# EAGLE design usb-volume (EAGLE 7.2.0)
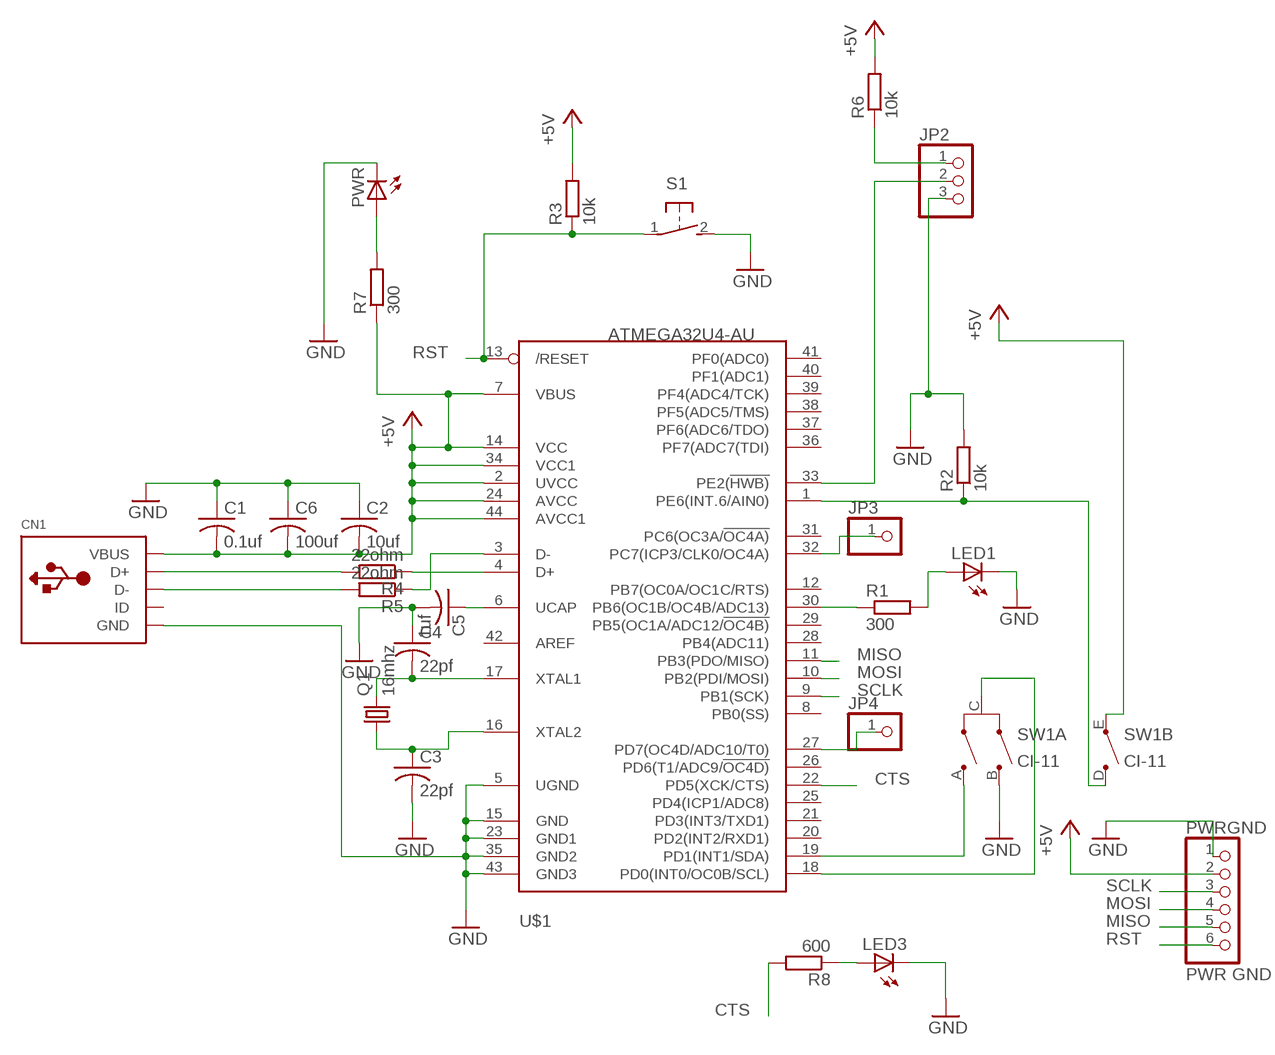
[diagram p0: schematic, sheet 1]

## Parts
C1  0.1uf  C-USC0805  [C0805]
C2  10uf  C-USC0805  [C0805]
C3  22pf  C-US025-025X050  [C025-025X050]
C4  22pf  C-US025-025X050  [C025-025X050]
C5  1uf  C-USC0805  [C0805]
C6  100uf  C-USC0805  [C0805]
CN1  USBMINIB  [USB-MINIB]
JP2  PINHD-1X3  [1X03]
JP3  PINHD-1X1  [1X01]
JP4  PINHD-1X1  [1X01]
LED1  LED5MM  [LED5MM]
LED3  LEDCHIPLED_1206  [CHIPLED_1206]
PWR  LEDCHIPLED_1206  [CHIPLED_1206]
PWRGND  PWR GND  PINHD-1X6  [1X06]
Q1  16mhz  CRYSTALHC49S  [HC49/S]
R1  300  R-EU_R0805  [R0805]
R2  10k  R-EU_R0805  [R0805]
R3  10k  R-EU_R0805  [R0805]
R4  22ohm  R-EU_R0805  [R0805]
R5  22ohm  R-EU_R0805  [R0805]
R6  10k  R-EU_R0805  [R0805]
R7  300  R-EU_R0805  [R0805]
R8  600  R-EU_R0805  [R0805]
S1  31-XX  [B3F-31XX]
SW1  CI-11  [CI-11]
U$1  ATMEGA32U4-AU  [TQFP44]

## Nets
+5V: C1.2 C2.2 C6.2 CN1.VBUS PWRGND.2 R3.2 R6.2 R7.1 SW1.E(B:E) U$1.2(UVCC) U$1.7(VBUS) U$1.14(VCC) U$1.24(AVCC) U$1.34(VCC1) U$1.44(AVCC1)
CTS: R8.2 U$1.22(PD5(XCK/CTS))
GND: C1.1 C2.1 C3.2 C4.1 C5.2 C6.1 CN1.GND JP2.3 LED1.K(C) LED3.C PWR.C PWRGND.1 R2.2 S1.2(S) SW1.B(A:B) U$1.5(UGND) U$1.15(GND) U$1.23(GND1) U$1.35(GND2) U$1.43(GND3)
MISO: PWRGND.5 U$1.11(PB3(PDO/MISO))
MOSI: PWRGND.4 U$1.10(PB2(PDI/MOSI))
N$1: SW1.C(A:C) U$1.18(PD0(INT0/OC0B/SCL))
N$2: SW1.A(A:A) U$1.19(PD1(INT1/SDA))
N$3: C4.2 Q1.2 U$1.17(XTAL1)
N$4: R2.1 SW1.D(B:D) U$1.1(PE6(INT.6/AIN0))
N$5: C3.1 Q1.1 U$1.16(XTAL2)
N$6: CN1.D+ R4.2
N$7: R5.1 U$1.3(D-)
N$8: R1.1 U$1.30(PB6(OC1B/OC4B/ADC13))
N$9: LED1.A R1.2
N$10: CN1.D- R5.2
N$11: R4.1 U$1.4(D+)
N$12: JP2.2 U$1.33(PE2(!HWB))
N$13: C5.1 U$1.6(UCAP)
N$14: JP2.1 R6.1
N$15: PWR.A R7.2
N$16: JP3.1 U$1.32(PC7(ICP3/CLK0/OC4A))
N$17: LED3.A R8.1
N$18: JP4.1 U$1.27(PD7(OC4D/ADC10/T0))
RST: PWRGND.6 R3.1 S1.1(P) U$1.13(/RESET)
SCLK: PWRGND.3 U$1.9(PB1(SCK))
Unconnected: CN1.ID U$1.8(PB0(SS)) U$1.12(PB7(OC0A/OC1C/RTS)) U$1.20(PD2(INT2/RXD1)) U$1.21(PD3(INT3/TXD1)) U$1.25(PD4(ICP1/ADC8)) U$1.26(PD6(T1/ADC9/!OC4D)) U$1.28(PB4(ADC11)) U$1.29(PB5(OC1A/ADC12/!OC4B)) U$1.31(PC6(OC3A/!OC4A)) U$1.36(PF7(ADC7(TDI)) U$1.37(PF6(ADC6/TDO)) U$1.38(PF5(ADC5/TMS)) U$1.39(PF4(ADC4/TCK)) U$1.40(PF1(ADC1)) U$1.41(PF0(ADC0)) U$1.42(AREF)

## Library data of the parts
C1-C6 = adafruit:C-US: CAPACITOR, American symbol
CN1 = adafruit:USB: USB Connectors USBMINIB - Surface Mount Female Mini-B USB Connector 4UConnector: 06564 By microbuilder.eu Thru-hole RA Female Mini-B USB Connector 4UConnector: 18732 By ladyada.net
JP2 = adafruit:PINHD-1X3: PIN HEADER
JP3 JP4 = adafruit:PINHD-1X1: Pin header 1x1 for 0.1" spacing With round pins
LED1 LED3 PWR = adafruit:LED: LED OSRAM: - CHIPLED LG R971, LG N971, LY N971, LG Q971, LY Q971, LO R971, LY R971 LH N974, LH R974 LS Q976, LO Q976, LY Q976 LO Q996 - Hyper CHIPLED LW Q18S LB Q993, LB Q99A, LB R99A - SideLED LS A670, LO A670, LY A670, LG A670, LP A670 LB A673, LV A673, LT A673, LW A673 LH A674 LY A675 LS A676, LA A676, LO A676, LY A676, LW A676 LS A679, LY A679, LG A679 - Hyper Micro SIDELED® LS Y876, LA Y876, LO Y876, LY Y876 LT Y87S - SmartLED LW L88C, LW L88S LB L89C, LB L89S, LG L890 LS L89K, LO L89K, LY L89K LS L896, LA L896, LO L896, LY L896 - TOPLED LS T670, LO T670, LY T670, LG T670, LP T670 LSG T670, LSP T670, LSY T670, LOP T670, LYG T670 LG T671, LOG T671, LSG T671 LB T673, LV T673, LT T673, LW T673 LH T674 LS T676, LA T676, LO T676, LY T676, LB T676, LH T676, LSB T676, LW T676 LB T67C, LV T67C, LT T67C, LS T67K, LO T67K, LY T67K, LW E67C LS E67B, LA E67B, LO E67B, LY E67B, LB E67C, LV E67C, LT E67C LW T67C LS T679, LY T679, LG T679 LS T770, LO T770, LY T770, LG T770, LP T770 LB T773, LV T773, LT T773, LW T773 LH T774 LS E675, LA E675, LY E675, LS T675 LS T776, LA T776, LO T776, LY T776, LB T776 LHGB T686 LT T68C, LB T68C - Hyper Mini TOPLED® LB M676 - Mini TOPLED Santana® LG M470 LS M47K, LO M47K, LY M47K Source: http://www.osram.convergy.de/
PWRGND = adafruit:PINHD-1X6: PIN HEADER
Q1 = adafruit:CRYSTAL: CRYSTAL; OC_FARNELL: 1667008; OC_NEWARK: unknown
R1-R8 = solar3-1:R-EU_: RESISTOR, European symbol
S1 = adafruit:31-XX: OMRON SWITCH Now with beefier pads!
SW1 = piher:CI-11: 11mm Incemental Encoder Source: www.piher.net .. 04-CI-11v04.pdf; OC_FARNELL: unknown; OC_NEWARK: unknown
U$1 = adafruit:ATMEGA32U4: http://www.ladyada.net/library/eagle

## Board
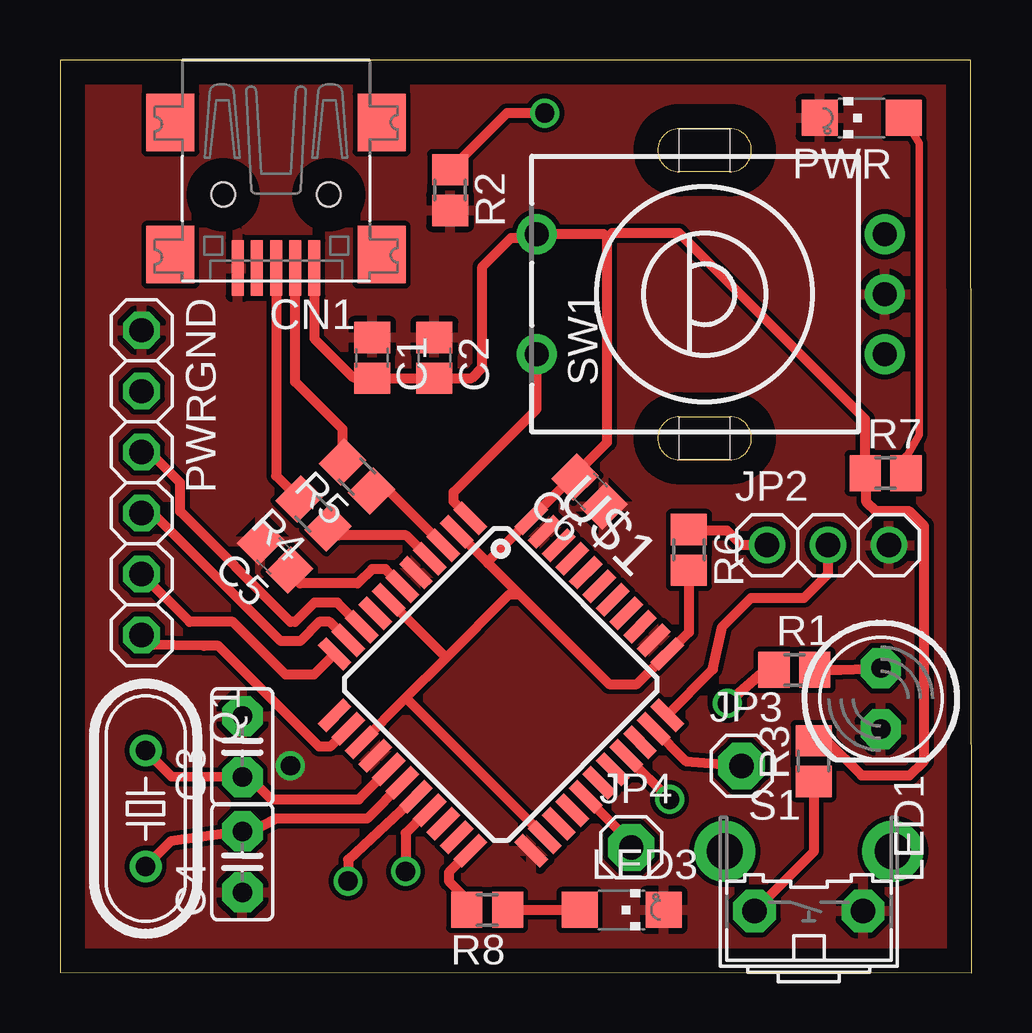
[diagram p1: board, top side]
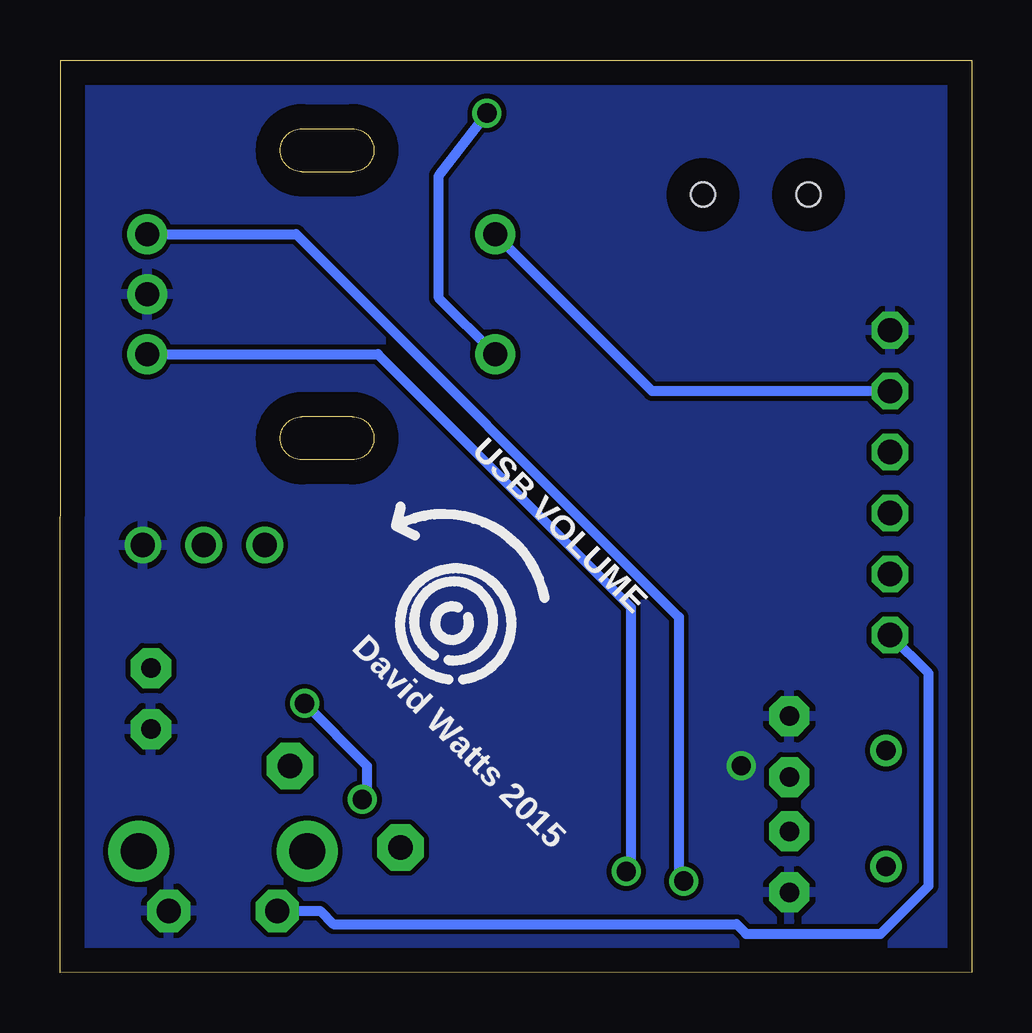
[diagram p2: board, bottom side, seen from below]

Size 37.99 x 38.03 mm. Coordinates in mm from the lower left corner, seen from the top.
Outline: 0,0.02 37.99,0 37.95,38.02 0.01,38.03 0,0.02
Copper layers (1*16): Top 0.035mm / dielectric 1.5mm / Bottom 0.035mm
Design rules "default": minimum track width 10mil, minimum drill 24mil, track to track 8mil, track to pad 8mil, pad to pad 8mil, via to via 8mil, smd to smd 8mil, copper to edge 40mil, drill to drill 8mil, minimum pad ring 10mil, minimum via ring 8mil, stop-mask expansion 4mil, vias tented up to drill 0mil, thermal gap 10mil

### Footprints (pad centres in the part's own frame; a part is rotated, then mirrored left to right if it is on the bottom)
C0805 = smd 1.3 x 1.5: 1 -0.85,0; 2 0.85,0
C025-025X050 = drill 0.813 pad 1.676 octagon: 1 -1.27,0; 2 1.27,0
USB-MINIB = smd 0.5 x 2.308: D+ 0,4.064; D- -0.8,4.064; GND 1.6,4.064; ID 0.8,4.064; VBUS -1.6,4.064 | smd 2 x 2.4: GND1 -4.4,-2; GND2 -4.4,3.5; GND3 4.4,3.5; GND4 4.4,-2 | hole 1: -2.2,1; 2.2,1
1X03 = drill 1.016: 1 -2.54,0; 2 0,0; 3 2.54,0
1X01 = drill 1.016 pad 1.93 octagon: 1 0,0
LED5MM = drill 0.813 pad 1.676 octagon: A -1.27,0; K 1.27,0
CHIPLED_1206 = smd 1.5 x 1.5: A 0,-1.75; C 0,1.75
1X06 = drill 1.016 octagon: 1 -6.35,0; 2 -3.81,0; 3 -1.27,0; 4 1.27,0; 5 3.81,0; 6 6.35,0
HC49/S = drill 0.813: 1 -2.413,0; 2 2.413,0
R0805 = smd 1.3 x 1.5: 1 -0.85,0; 2 0.85,0
B3F-31XX = drill 1.016 pad 1.778 octagon: 1 -2.261,-1.245; 2 2.261,-1.245 | drill 1.499 pad 2.54: 3 -3.505,1.245; 4 3.505,1.245
CI-11 = drill 1 pad 1.676: A -2.5,-7.5; B 0,-7.5; C 2.5,-7.5; D -2.5,7; E 2.5,7
TQFP44 = smd 1.5 x 0.5: 1 -5.8,4; 2 -5.8,3.2; 3 -5.8,2.4; 4 -5.8,1.6; 5 -5.8,0.8; 6 -5.8,0; 7 -5.8,-0.8; 8 -5.8,-1.6; 9 -5.8,-2.4; 10 -5.8,-3.2; 11 -5.8,-4; 23 5.8,-4; 24 5.8,-3.2; 25 5.8,-2.4; 26 5.8,-1.6; 27 5.8,-0.8; 28 5.8,0; 29 5.8,0.8; 30 5.8,1.6; 31 5.8,2.4; 32 5.8,3.2; 33 5.8,4 | smd 0.5 x 1.5: 12 -4,-5.8; 13 -3.2,-5.8; 14 -2.4,-5.8; 15 -1.6,-5.8; 16 -0.8,-5.8; 17 0,-5.8; 18 0.8,-5.8; 19 1.6,-5.8; 20 2.4,-5.8; 21 3.2,-5.8; 22 4,-5.8; 34 4,5.8; 35 3.2,5.8; 36 2.4,5.8; 37 1.6,5.8; 38 0.8,5.8; 39 0,5.8; 40 -0.8,5.8; 41 -1.6,5.8; 42 -2.4,5.8; 43 -3.2,5.8; 44 -4,5.8

### Placement (x,y rotation side)
C1  13,25.62 270 top
C2  15.6,25.62 270 top
C3  7.6,9.42 90 top
C4  7.6,4.62 90 top
C5  8.95,17.37 135 top
C6  22.06,20.04 135 top
CN1  9,33.42 180 top
JP2  32,17.82 0 top
JP3  28.4,8.62 0 top
JP4  23.8,5.22 0 top
LED1  34.2,11.42 270 top
LED3  23.4,2.62 270 top
PWR  33.4,35.62 90 top
PWRGND  3.4,20.42 270 top
Q1  3.57,6.84 270 top
R1  30.6,12.62 0 top
R2  16.26,32.61 270 top
R3  31.4,8.82 90 top
R4  10.57,19.14 135 top
R5  12.38,20.68 135 top
R6  26.2,17.62 270 top
R7  34.4,20.82 0 top
R8  17.8,2.62 180 top
S1  31.2,3.82 0 top
SW1  26.86,28.27 90 top
U$1  18.37,12.01 315 top

### Tracks (layer width: path | path; a pad name or v marks a point on that pad's centre or on a via)
+5V
  Top 0.406: U$1.2 17.84,17.06 | 17.84,17.06 19.14,15.76 | 19.14,15.76 22.88,12.02 24.04,12.02 U$1.34 26.2,14.18 R6.2 | 17.84,17.06 17.84,17.14 U$1.44 21.35,20.64 | U$1.14 14.39,11.43 | 14.39,11.43 16.09,13.13 | 16.09,13.13 18.73,15.76 19.14,15.76 | U$1.24 19.82,6.03 | 19.82,6.03 14.42,11.43 14.39,11.43 | CN1.VBUS 10.6,26.42 12.2,24.82 12.95,24.82 C1.2 C2.2 17.15,24.77 17.6,25.22 17.6,29.42 18.8,30.62 19.71,30.62 SW1.E 22.65,30.77 22.8,30.62 | C6.2 21.35,20.64 | 21.35,20.64 22.8,22.1 22.8,30.62 | U$1.7 13.7,15.52 16.09,13.13 | 22.8,30.62 23,30.82 25.8,30.82 33.55,23.07 R7.1 33.6,20.77 33.6,19.62 34,19.22 35.4,19.22 36,18.62 36,8.82 35.4,8.22 33.4,8.22 31.95,9.67 R3.2 31.35,9.62 | 19.82,6 19.82,6.03
  Bottom 0.406: PWRGND.2 13.32,24.23 SW1.E
CTS
  Top 0.406: U$1.22 16.2,4.18 16.2,3.82 16.95,3.07 R8.2
GND  (via drill 0.8)
  other vias: 9.6,8.62
  pour Bottom: -3.81,41.93 43.18,41.93 43.18,-6.33 -3.81,-6.33
  pour Top: -6.35,45.74 48.26,45.74 48.26,-7.6 -6.75,-7.2
MISO
  Top 0.406: U$1.11 10.58,12.42 9.4,12.42 7.2,14.62 5.4,14.62 PWRGND.5
MOSI
  Top 0.406: U$1.10 11.23,14.62 10.8,14.62 10,13.82 9.2,13.82 3.87,19.15 PWRGND.4
N$1  (via drill 0.8)
  Top 0.406: U$1.18 12,4.71 v12,3.82
  Bottom 0.406: v12,3.82 12.2,4.02 12.2,14.82 28.15,30.77 SW1.C
N$2  (via drill 0.8)
  Top 0.406: v14.4,4.22 14.4,5.82 15.2,6.62 U$1.19
  Bottom 0.406: SW1.A 24.75,25.77 14.2,15.22 14.2,4.42 v14.4,4.22
N$3
  Top 0.406: U$1.17 14.27,7.89 12.8,6.42 9,6.42 7.85,5.82 C4.2 4.61,5.47 Q1.2
N$4  (via drill 0.8)
  Top 0.406: U$1.1 16.4,19.63 16.4,20.02 19.86,23.48 SW1.D | v20.2,35.82 18.62,35.82 R2.1
  Bottom 0.406: SW1.D 22.2,28.11 22.2,33.22 v20.2,35.82
N$5
  Top 0.406: U$1.16 12.45,7.22 8.8,7.22 8.05,7.97 C3.1 4.65,8.17 Q1.1
N$6
  Top 0.406: CN1.D+ 9,20.7 R4.2
N$7
  Top 0.406: U$1.3 13.69,20.08 R5.1
N$8  (via drill 0.8)
  Top 0.406: v27.8,11.22 29.4,12.62 R1.1 | v25.4,7.22 23.6,9.02 U$1.30
  Bottom 0.406: v27.8,11.22 25.2,8.62 25.2,7.42 v25.4,7.22
N$9
  Top 0.406: R1.2 32.53,12.62 LED1.A
N$10
  Top 0.406: R5.2 11.78,22.64 9.8,24.62 CN1.D-
N$11
  Top 0.406: U$1.4 14.42,18.22 11.6,18.22 11.28,18.54 R4.1
N$12
  Top 0.406: U$1.33 27.2,12.64 27.6,14.42 28.8,15.62 31,15.62 32,16.62 JP2.2
N$13
  Top 0.406: U$1.6 13.56,16.82 13,16.82 12.4,16.22 10,16.22 9.55,16.67 C5.1
N$14
  Top 0.406: JP2.1 28.4,17.82 27.8,18.42 26.25,18.42 R6.1
N$15
  Top 0.305: 35.25,21.47 35.8,22.42 35.8,34.57 PWR.A
  Top 0.406: R7.2 35.25,21.47
N$16
  Top 0.406: U$1.32 26.08,8.82 JP3.1
N$17
  Top 0.406: R8.1 LED3.A
N$18
  Top 0.406: U$1.27 21.9,7.32 23.4,5.82 23.4,5.62 JP4.1
RST
  Top 0.406: U$1.13 11.26,9.42 10.8,9.42 6.6,13.62 6,13.62 3.55,13.67 PWRGND.6 | S1.1 31.4,5.04 R3.1
  Bottom 0.406: S1.1 27.16,2.58 26.6,2.02 9.8,2.02 9.4,1.62 3.8,1.62 1.8,3.62 1.8,12.47 PWRGND.6
SCLK
  Top 0.406: U$1.9 11.56,15.42 10.6,15.42 9.8,14.62 9.6,14.62 5,19.22 5,20.42 3.73,21.69 PWRGND.3

### Text on the board
_bsilk: USB VOLUME | David Watts 2015